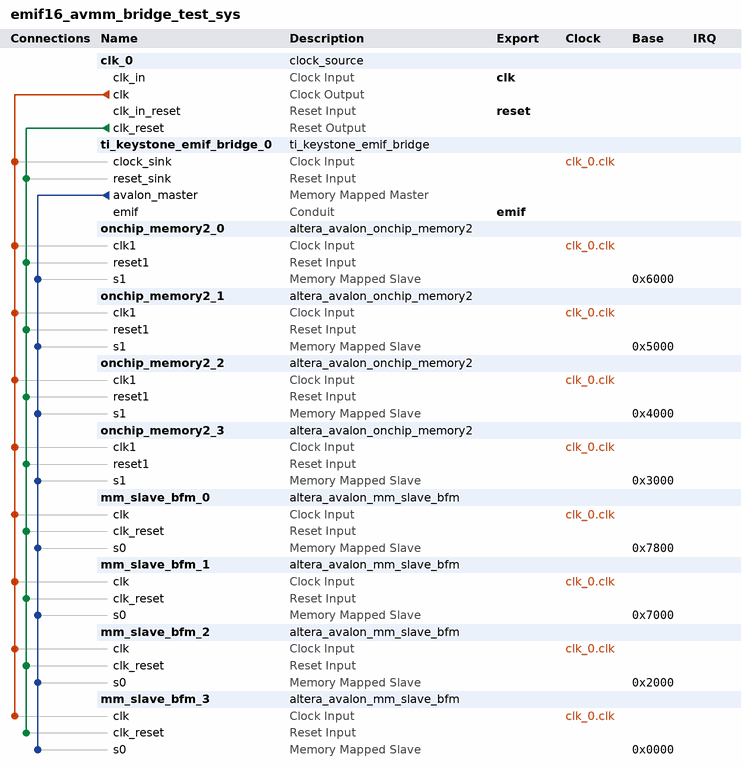
[diagram p0: system contents]
# Platform Designer (Qsys) system emif16_avmm_bridge_test_sys, Cyclone V 5CEBA2F17A7
# Parameters at their usual value, and those the tool derives, are not listed.
package require -exact qsys 15.1
create_system emif16_avmm_bridge_test_sys
set_project_property DEVICE_FAMILY {Cyclone V}
set_project_property DEVICE 5CEBA2F17A7

add_instance clk_0 clock_source 15.1
set_instance_parameter_value clk_0 clockFrequency 50000000

add_instance ti_keystone_emif_bridge_0 ti_keystone_emif_bridge 1.0
set_instance_parameter_value ti_keystone_emif_bridge_0 HOLD_CYCLES 2
set_instance_parameter_value ti_keystone_emif_bridge_0 SYNC_STAGES 2

add_instance onchip_memory2_0 altera_avalon_onchip_memory2 15.1
set_instance_parameter_value onchip_memory2_0 dataWidth 8
set_instance_parameter_value onchip_memory2_0 dualPort false
set_instance_parameter_value onchip_memory2_0 initMemContent false
set_instance_parameter_value onchip_memory2_0 initializationFileName onchip_mem.hex
set_instance_parameter_value onchip_memory2_0 memorySize 4096

add_instance onchip_memory2_1 altera_avalon_onchip_memory2 15.1
set_instance_parameter_value onchip_memory2_1 dataWidth 16
set_instance_parameter_value onchip_memory2_1 dualPort false
set_instance_parameter_value onchip_memory2_1 initMemContent false
set_instance_parameter_value onchip_memory2_1 initializationFileName onchip_mem.hex
set_instance_parameter_value onchip_memory2_1 memorySize 4096

add_instance onchip_memory2_2 altera_avalon_onchip_memory2 15.1
set_instance_parameter_value onchip_memory2_2 dataWidth 32
set_instance_parameter_value onchip_memory2_2 dualPort false
set_instance_parameter_value onchip_memory2_2 initMemContent false
set_instance_parameter_value onchip_memory2_2 initializationFileName onchip_mem.hex
set_instance_parameter_value onchip_memory2_2 memorySize 4096

add_instance onchip_memory2_3 altera_avalon_onchip_memory2 15.1
set_instance_parameter_value onchip_memory2_3 dataWidth 64
set_instance_parameter_value onchip_memory2_3 dualPort false
set_instance_parameter_value onchip_memory2_3 initMemContent false
set_instance_parameter_value onchip_memory2_3 initializationFileName onchip_mem.hex
set_instance_parameter_value onchip_memory2_3 memorySize 4096

add_instance mm_slave_bfm_0 altera_avalon_mm_slave_bfm 15.1
set_instance_parameter_value mm_slave_bfm_0 ADDRESS_UNITS WORDS
set_instance_parameter_value mm_slave_bfm_0 ASSERT_HIGH_ARBITERLOCK 1
set_instance_parameter_value mm_slave_bfm_0 ASSERT_HIGH_BYTEENABLE 1
set_instance_parameter_value mm_slave_bfm_0 ASSERT_HIGH_LOCK 1
set_instance_parameter_value mm_slave_bfm_0 ASSERT_HIGH_READ 1
set_instance_parameter_value mm_slave_bfm_0 ASSERT_HIGH_READDATAVALID 1
set_instance_parameter_value mm_slave_bfm_0 ASSERT_HIGH_RESET 1
set_instance_parameter_value mm_slave_bfm_0 ASSERT_HIGH_WAITREQUEST 1
set_instance_parameter_value mm_slave_bfm_0 ASSERT_HIGH_WRITE 1
set_instance_parameter_value mm_slave_bfm_0 AV_ADDRESS_W 10
set_instance_parameter_value mm_slave_bfm_0 AV_BURSTCOUNT_W 3
set_instance_parameter_value mm_slave_bfm_0 AV_BURST_BNDR_ONLY 1
set_instance_parameter_value mm_slave_bfm_0 AV_BURST_LINEWRAP 1
set_instance_parameter_value mm_slave_bfm_0 AV_FIX_READ_LATENCY 0
set_instance_parameter_value mm_slave_bfm_0 AV_MAX_PENDING_READS 1
set_instance_parameter_value mm_slave_bfm_0 AV_MAX_PENDING_WRITES 0
set_instance_parameter_value mm_slave_bfm_0 AV_NUMSYMBOLS 1
set_instance_parameter_value mm_slave_bfm_0 AV_READRESPONSE_W 8
set_instance_parameter_value mm_slave_bfm_0 AV_READ_WAIT_TIME 1
set_instance_parameter_value mm_slave_bfm_0 AV_REGISTERINCOMINGSIGNALS 0
set_instance_parameter_value mm_slave_bfm_0 AV_SYMBOL_W 8
set_instance_parameter_value mm_slave_bfm_0 AV_WRITERESPONSE_W 8
set_instance_parameter_value mm_slave_bfm_0 AV_WRITE_WAIT_TIME 0
set_instance_parameter_value mm_slave_bfm_0 REGISTER_WAITREQUEST 0
set_instance_parameter_value mm_slave_bfm_0 USE_ADDRESS 1
set_instance_parameter_value mm_slave_bfm_0 USE_ARBITERLOCK 0
set_instance_parameter_value mm_slave_bfm_0 USE_BEGIN_BURST_TRANSFER 0
set_instance_parameter_value mm_slave_bfm_0 USE_BEGIN_TRANSFER 0
set_instance_parameter_value mm_slave_bfm_0 USE_BURSTCOUNT 1
set_instance_parameter_value mm_slave_bfm_0 USE_BYTE_ENABLE 1
set_instance_parameter_value mm_slave_bfm_0 USE_CLKEN 0
set_instance_parameter_value mm_slave_bfm_0 USE_DEBUGACCESS 0
set_instance_parameter_value mm_slave_bfm_0 USE_LOCK 0
set_instance_parameter_value mm_slave_bfm_0 USE_READ 1
set_instance_parameter_value mm_slave_bfm_0 USE_READRESPONSE 0
set_instance_parameter_value mm_slave_bfm_0 USE_READ_DATA 1
set_instance_parameter_value mm_slave_bfm_0 USE_READ_DATA_VALID 1
set_instance_parameter_value mm_slave_bfm_0 USE_TRANSACTIONID 0
set_instance_parameter_value mm_slave_bfm_0 USE_WAIT_REQUEST 1
set_instance_parameter_value mm_slave_bfm_0 USE_WRITE 1
set_instance_parameter_value mm_slave_bfm_0 USE_WRITERESPONSE 0
set_instance_parameter_value mm_slave_bfm_0 USE_WRITE_DATA 1
set_instance_parameter_value mm_slave_bfm_0 VHDL_ID 0

add_instance mm_slave_bfm_1 altera_avalon_mm_slave_bfm 15.1
set_instance_parameter_value mm_slave_bfm_1 ADDRESS_UNITS WORDS
set_instance_parameter_value mm_slave_bfm_1 ASSERT_HIGH_ARBITERLOCK 1
set_instance_parameter_value mm_slave_bfm_1 ASSERT_HIGH_BYTEENABLE 1
set_instance_parameter_value mm_slave_bfm_1 ASSERT_HIGH_LOCK 1
set_instance_parameter_value mm_slave_bfm_1 ASSERT_HIGH_READ 1
set_instance_parameter_value mm_slave_bfm_1 ASSERT_HIGH_READDATAVALID 1
set_instance_parameter_value mm_slave_bfm_1 ASSERT_HIGH_RESET 1
set_instance_parameter_value mm_slave_bfm_1 ASSERT_HIGH_WAITREQUEST 1
set_instance_parameter_value mm_slave_bfm_1 ASSERT_HIGH_WRITE 1
set_instance_parameter_value mm_slave_bfm_1 AV_ADDRESS_W 10
set_instance_parameter_value mm_slave_bfm_1 AV_BURSTCOUNT_W 3
set_instance_parameter_value mm_slave_bfm_1 AV_BURST_BNDR_ONLY 1
set_instance_parameter_value mm_slave_bfm_1 AV_BURST_LINEWRAP 1
set_instance_parameter_value mm_slave_bfm_1 AV_FIX_READ_LATENCY 0
set_instance_parameter_value mm_slave_bfm_1 AV_MAX_PENDING_READS 1
set_instance_parameter_value mm_slave_bfm_1 AV_MAX_PENDING_WRITES 0
set_instance_parameter_value mm_slave_bfm_1 AV_NUMSYMBOLS 2
set_instance_parameter_value mm_slave_bfm_1 AV_READRESPONSE_W 8
set_instance_parameter_value mm_slave_bfm_1 AV_READ_WAIT_TIME 1
set_instance_parameter_value mm_slave_bfm_1 AV_REGISTERINCOMINGSIGNALS 0
set_instance_parameter_value mm_slave_bfm_1 AV_SYMBOL_W 8
set_instance_parameter_value mm_slave_bfm_1 AV_WRITERESPONSE_W 8
set_instance_parameter_value mm_slave_bfm_1 AV_WRITE_WAIT_TIME 0
set_instance_parameter_value mm_slave_bfm_1 REGISTER_WAITREQUEST 0
set_instance_parameter_value mm_slave_bfm_1 USE_ADDRESS 1
set_instance_parameter_value mm_slave_bfm_1 USE_ARBITERLOCK 0
set_instance_parameter_value mm_slave_bfm_1 USE_BEGIN_BURST_TRANSFER 0
set_instance_parameter_value mm_slave_bfm_1 USE_BEGIN_TRANSFER 0
set_instance_parameter_value mm_slave_bfm_1 USE_BURSTCOUNT 1
set_instance_parameter_value mm_slave_bfm_1 USE_BYTE_ENABLE 1
set_instance_parameter_value mm_slave_bfm_1 USE_CLKEN 0
set_instance_parameter_value mm_slave_bfm_1 USE_DEBUGACCESS 0
set_instance_parameter_value mm_slave_bfm_1 USE_LOCK 0
set_instance_parameter_value mm_slave_bfm_1 USE_READ 1
set_instance_parameter_value mm_slave_bfm_1 USE_READRESPONSE 0
set_instance_parameter_value mm_slave_bfm_1 USE_READ_DATA 1
set_instance_parameter_value mm_slave_bfm_1 USE_READ_DATA_VALID 1
set_instance_parameter_value mm_slave_bfm_1 USE_TRANSACTIONID 0
set_instance_parameter_value mm_slave_bfm_1 USE_WAIT_REQUEST 1
set_instance_parameter_value mm_slave_bfm_1 USE_WRITE 1
set_instance_parameter_value mm_slave_bfm_1 USE_WRITERESPONSE 0
set_instance_parameter_value mm_slave_bfm_1 USE_WRITE_DATA 1
set_instance_parameter_value mm_slave_bfm_1 VHDL_ID 0

add_instance mm_slave_bfm_2 altera_avalon_mm_slave_bfm 15.1
set_instance_parameter_value mm_slave_bfm_2 ADDRESS_UNITS WORDS
set_instance_parameter_value mm_slave_bfm_2 ASSERT_HIGH_ARBITERLOCK 1
set_instance_parameter_value mm_slave_bfm_2 ASSERT_HIGH_BYTEENABLE 1
set_instance_parameter_value mm_slave_bfm_2 ASSERT_HIGH_LOCK 1
set_instance_parameter_value mm_slave_bfm_2 ASSERT_HIGH_READ 1
set_instance_parameter_value mm_slave_bfm_2 ASSERT_HIGH_READDATAVALID 1
set_instance_parameter_value mm_slave_bfm_2 ASSERT_HIGH_RESET 1
set_instance_parameter_value mm_slave_bfm_2 ASSERT_HIGH_WAITREQUEST 1
set_instance_parameter_value mm_slave_bfm_2 ASSERT_HIGH_WRITE 1
set_instance_parameter_value mm_slave_bfm_2 AV_ADDRESS_W 10
set_instance_parameter_value mm_slave_bfm_2 AV_BURSTCOUNT_W 3
set_instance_parameter_value mm_slave_bfm_2 AV_BURST_BNDR_ONLY 1
set_instance_parameter_value mm_slave_bfm_2 AV_BURST_LINEWRAP 1
set_instance_parameter_value mm_slave_bfm_2 AV_FIX_READ_LATENCY 0
set_instance_parameter_value mm_slave_bfm_2 AV_MAX_PENDING_READS 1
set_instance_parameter_value mm_slave_bfm_2 AV_MAX_PENDING_WRITES 0
set_instance_parameter_value mm_slave_bfm_2 AV_NUMSYMBOLS 4
set_instance_parameter_value mm_slave_bfm_2 AV_READRESPONSE_W 8
set_instance_parameter_value mm_slave_bfm_2 AV_READ_WAIT_TIME 1
set_instance_parameter_value mm_slave_bfm_2 AV_REGISTERINCOMINGSIGNALS 0
set_instance_parameter_value mm_slave_bfm_2 AV_SYMBOL_W 8
set_instance_parameter_value mm_slave_bfm_2 AV_WRITERESPONSE_W 8
set_instance_parameter_value mm_slave_bfm_2 AV_WRITE_WAIT_TIME 0
set_instance_parameter_value mm_slave_bfm_2 REGISTER_WAITREQUEST 0
set_instance_parameter_value mm_slave_bfm_2 USE_ADDRESS 1
set_instance_parameter_value mm_slave_bfm_2 USE_ARBITERLOCK 0
set_instance_parameter_value mm_slave_bfm_2 USE_BEGIN_BURST_TRANSFER 0
set_instance_parameter_value mm_slave_bfm_2 USE_BEGIN_TRANSFER 0
set_instance_parameter_value mm_slave_bfm_2 USE_BURSTCOUNT 1
set_instance_parameter_value mm_slave_bfm_2 USE_BYTE_ENABLE 1
set_instance_parameter_value mm_slave_bfm_2 USE_CLKEN 0
set_instance_parameter_value mm_slave_bfm_2 USE_DEBUGACCESS 0
set_instance_parameter_value mm_slave_bfm_2 USE_LOCK 0
set_instance_parameter_value mm_slave_bfm_2 USE_READ 1
set_instance_parameter_value mm_slave_bfm_2 USE_READRESPONSE 0
set_instance_parameter_value mm_slave_bfm_2 USE_READ_DATA 1
set_instance_parameter_value mm_slave_bfm_2 USE_READ_DATA_VALID 1
set_instance_parameter_value mm_slave_bfm_2 USE_TRANSACTIONID 0
set_instance_parameter_value mm_slave_bfm_2 USE_WAIT_REQUEST 1
set_instance_parameter_value mm_slave_bfm_2 USE_WRITE 1
set_instance_parameter_value mm_slave_bfm_2 USE_WRITERESPONSE 0
set_instance_parameter_value mm_slave_bfm_2 USE_WRITE_DATA 1
set_instance_parameter_value mm_slave_bfm_2 VHDL_ID 0

add_instance mm_slave_bfm_3 altera_avalon_mm_slave_bfm 15.1
set_instance_parameter_value mm_slave_bfm_3 ADDRESS_UNITS WORDS
set_instance_parameter_value mm_slave_bfm_3 ASSERT_HIGH_ARBITERLOCK 1
set_instance_parameter_value mm_slave_bfm_3 ASSERT_HIGH_BYTEENABLE 1
set_instance_parameter_value mm_slave_bfm_3 ASSERT_HIGH_LOCK 1
set_instance_parameter_value mm_slave_bfm_3 ASSERT_HIGH_READ 1
set_instance_parameter_value mm_slave_bfm_3 ASSERT_HIGH_READDATAVALID 1
set_instance_parameter_value mm_slave_bfm_3 ASSERT_HIGH_RESET 1
set_instance_parameter_value mm_slave_bfm_3 ASSERT_HIGH_WAITREQUEST 1
set_instance_parameter_value mm_slave_bfm_3 ASSERT_HIGH_WRITE 1
set_instance_parameter_value mm_slave_bfm_3 AV_ADDRESS_W 10
set_instance_parameter_value mm_slave_bfm_3 AV_BURSTCOUNT_W 3
set_instance_parameter_value mm_slave_bfm_3 AV_BURST_BNDR_ONLY 1
set_instance_parameter_value mm_slave_bfm_3 AV_BURST_LINEWRAP 1
set_instance_parameter_value mm_slave_bfm_3 AV_FIX_READ_LATENCY 0
set_instance_parameter_value mm_slave_bfm_3 AV_MAX_PENDING_READS 1
set_instance_parameter_value mm_slave_bfm_3 AV_MAX_PENDING_WRITES 0
set_instance_parameter_value mm_slave_bfm_3 AV_NUMSYMBOLS 8
set_instance_parameter_value mm_slave_bfm_3 AV_READRESPONSE_W 8
set_instance_parameter_value mm_slave_bfm_3 AV_READ_WAIT_TIME 1
set_instance_parameter_value mm_slave_bfm_3 AV_REGISTERINCOMINGSIGNALS 0
set_instance_parameter_value mm_slave_bfm_3 AV_SYMBOL_W 8
set_instance_parameter_value mm_slave_bfm_3 AV_WRITERESPONSE_W 8
set_instance_parameter_value mm_slave_bfm_3 AV_WRITE_WAIT_TIME 0
set_instance_parameter_value mm_slave_bfm_3 REGISTER_WAITREQUEST 0
set_instance_parameter_value mm_slave_bfm_3 USE_ADDRESS 1
set_instance_parameter_value mm_slave_bfm_3 USE_ARBITERLOCK 0
set_instance_parameter_value mm_slave_bfm_3 USE_BEGIN_BURST_TRANSFER 0
set_instance_parameter_value mm_slave_bfm_3 USE_BEGIN_TRANSFER 0
set_instance_parameter_value mm_slave_bfm_3 USE_BURSTCOUNT 1
set_instance_parameter_value mm_slave_bfm_3 USE_BYTE_ENABLE 1
set_instance_parameter_value mm_slave_bfm_3 USE_CLKEN 0
set_instance_parameter_value mm_slave_bfm_3 USE_DEBUGACCESS 0
set_instance_parameter_value mm_slave_bfm_3 USE_LOCK 0
set_instance_parameter_value mm_slave_bfm_3 USE_READ 1
set_instance_parameter_value mm_slave_bfm_3 USE_READRESPONSE 0
set_instance_parameter_value mm_slave_bfm_3 USE_READ_DATA 1
set_instance_parameter_value mm_slave_bfm_3 USE_READ_DATA_VALID 1
set_instance_parameter_value mm_slave_bfm_3 USE_TRANSACTIONID 0
set_instance_parameter_value mm_slave_bfm_3 USE_WAIT_REQUEST 1
set_instance_parameter_value mm_slave_bfm_3 USE_WRITE 1
set_instance_parameter_value mm_slave_bfm_3 USE_WRITERESPONSE 0
set_instance_parameter_value mm_slave_bfm_3 USE_WRITE_DATA 1
set_instance_parameter_value mm_slave_bfm_3 VHDL_ID 0

# connections
add_connection clk_0.clk mm_slave_bfm_0.clk clock
add_connection clk_0.clk mm_slave_bfm_1.clk clock
add_connection clk_0.clk mm_slave_bfm_2.clk clock
add_connection clk_0.clk mm_slave_bfm_3.clk clock
add_connection clk_0.clk onchip_memory2_0.clk1 clock
add_connection clk_0.clk onchip_memory2_1.clk1 clock
add_connection clk_0.clk onchip_memory2_2.clk1 clock
add_connection clk_0.clk onchip_memory2_3.clk1 clock
add_connection clk_0.clk ti_keystone_emif_bridge_0.clock_sink clock
add_connection clk_0.clk_reset mm_slave_bfm_0.clk_reset reset
add_connection clk_0.clk_reset mm_slave_bfm_1.clk_reset reset
add_connection clk_0.clk_reset mm_slave_bfm_2.clk_reset reset
add_connection clk_0.clk_reset mm_slave_bfm_3.clk_reset reset
add_connection clk_0.clk_reset onchip_memory2_0.reset1 reset
add_connection clk_0.clk_reset onchip_memory2_1.reset1 reset
add_connection clk_0.clk_reset onchip_memory2_2.reset1 reset
add_connection clk_0.clk_reset onchip_memory2_3.reset1 reset
add_connection clk_0.clk_reset ti_keystone_emif_bridge_0.reset_sink reset
add_connection ti_keystone_emif_bridge_0.avalon_master mm_slave_bfm_0.s0 avalon
set_connection_parameter_value ti_keystone_emif_bridge_0.avalon_master/mm_slave_bfm_0.s0 baseAddress 0x7800
add_connection ti_keystone_emif_bridge_0.avalon_master mm_slave_bfm_1.s0 avalon
set_connection_parameter_value ti_keystone_emif_bridge_0.avalon_master/mm_slave_bfm_1.s0 baseAddress 0x7000
add_connection ti_keystone_emif_bridge_0.avalon_master mm_slave_bfm_2.s0 avalon
set_connection_parameter_value ti_keystone_emif_bridge_0.avalon_master/mm_slave_bfm_2.s0 baseAddress 0x2000
add_connection ti_keystone_emif_bridge_0.avalon_master mm_slave_bfm_3.s0 avalon
set_connection_parameter_value ti_keystone_emif_bridge_0.avalon_master/mm_slave_bfm_3.s0 baseAddress 0x0000
add_connection ti_keystone_emif_bridge_0.avalon_master onchip_memory2_0.s1 avalon
set_connection_parameter_value ti_keystone_emif_bridge_0.avalon_master/onchip_memory2_0.s1 baseAddress 0x6000
add_connection ti_keystone_emif_bridge_0.avalon_master onchip_memory2_1.s1 avalon
set_connection_parameter_value ti_keystone_emif_bridge_0.avalon_master/onchip_memory2_1.s1 baseAddress 0x5000
add_connection ti_keystone_emif_bridge_0.avalon_master onchip_memory2_2.s1 avalon
set_connection_parameter_value ti_keystone_emif_bridge_0.avalon_master/onchip_memory2_2.s1 baseAddress 0x4000
add_connection ti_keystone_emif_bridge_0.avalon_master onchip_memory2_3.s1 avalon
set_connection_parameter_value ti_keystone_emif_bridge_0.avalon_master/onchip_memory2_3.s1 baseAddress 0x3000

# exported interfaces
add_interface clk clock sink
set_interface_property clk EXPORT_OF clk_0.clk_in
add_interface emif conduit end
set_interface_property emif EXPORT_OF ti_keystone_emif_bridge_0.emif
add_interface reset reset sink
set_interface_property reset EXPORT_OF clk_0.clk_in_reset

set_interconnect_requirement {$system} qsys_mm.clockCrossingAdapter HANDSHAKE
set_interconnect_requirement {$system} qsys_mm.enableEccProtection FALSE
set_interconnect_requirement {$system} qsys_mm.insertDefaultSlave FALSE
set_interconnect_requirement {$system} qsys_mm.maxAdditionalLatency 1

save_system emif16_avmm_bridge_test_sys.qsys
